# Altium schematic sheet Power.SchDoc
size Letter; Author: Patrick Maroney; Organization: Machine Intelligence Lab; SheetNumber: 2; DocumentName: Status Board
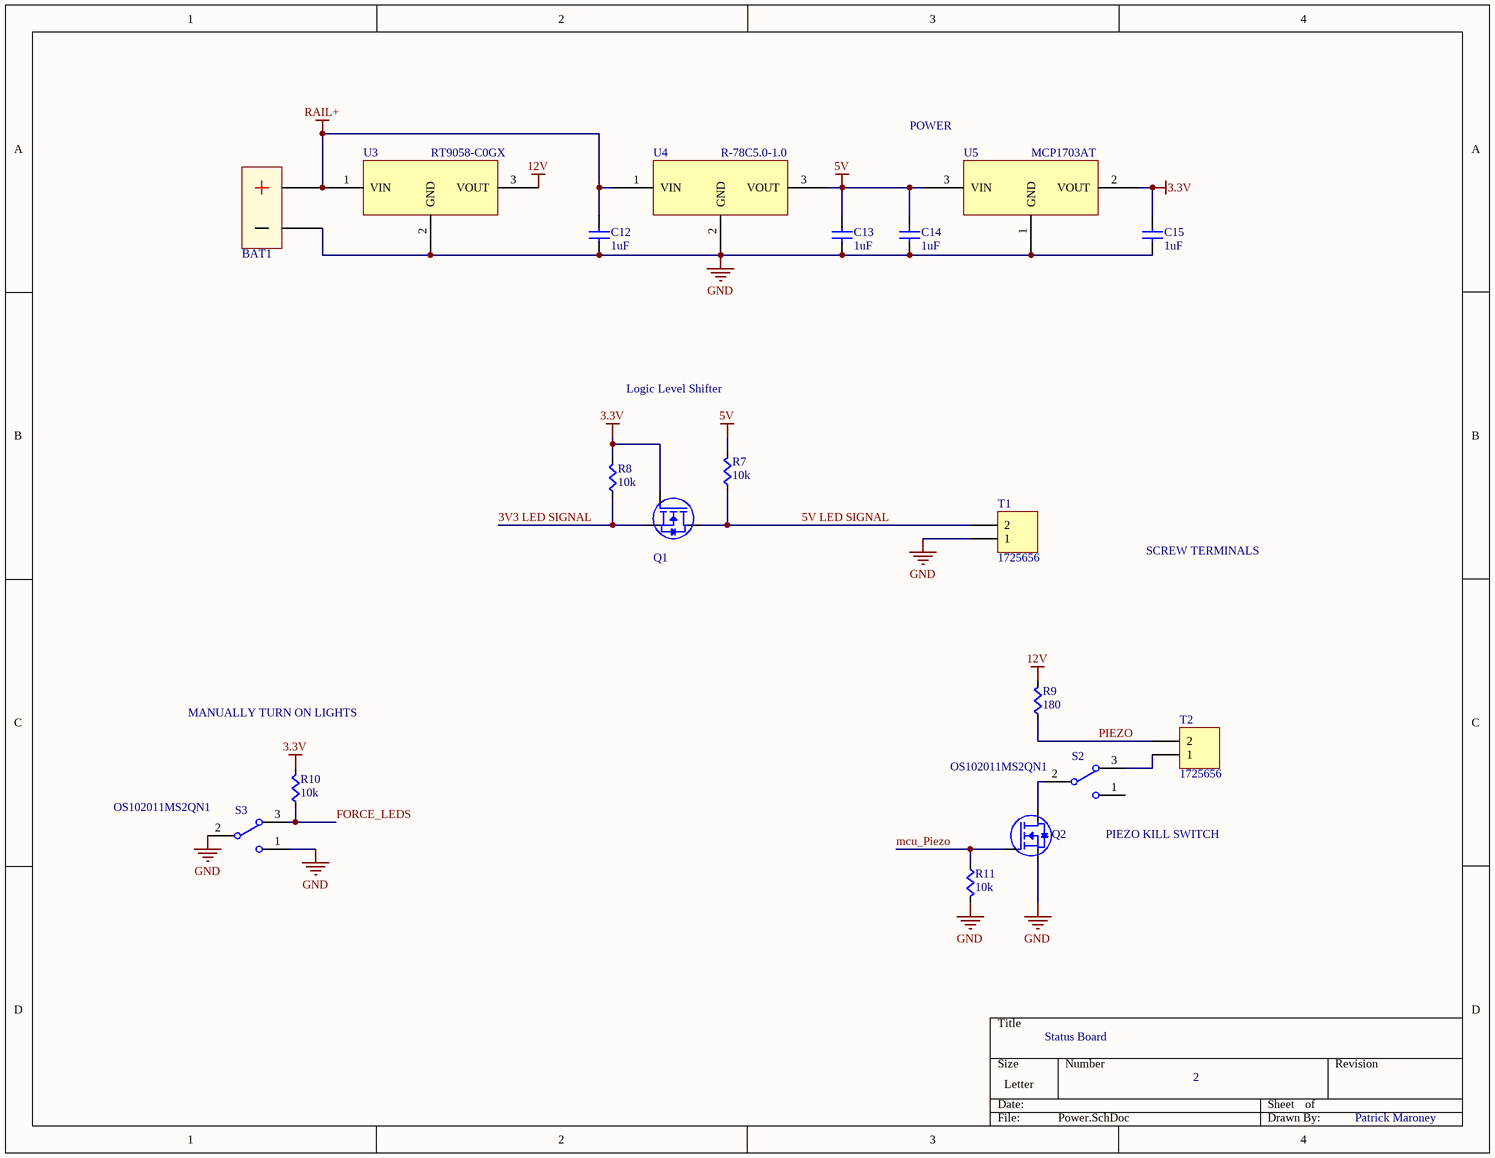
[diagram p0: Power.SchDoc]

## Parts
BAT1  BATWIRE  [BATWIRE12]  (value not drawn)
C12  value 1uF  [CAPC0603]  (hidden comment: Cap)
C13  value 1uF  [CAPC0603]  (hidden comment: Cap)
C14  value 1uF  [CAPC0603]  (hidden comment: Cap)
C15  value 1uF  [CAPC0603]  (hidden comment: Cap)
Q1  BSS138  [BSS138]  (value not drawn)
Q2  TPCA8052-H(TE12LQM  [TPCA8052-H(TE12LQM]  (value not drawn)
R7  value 10k  [RES0603]  (hidden comment: Res)
R8  value 10k  [RES0603]  (hidden comment: Res)
R9  value 180  [RES0603]  (hidden comment: Res)
R10  value 10k  [RES0603]  (hidden comment: Res)
R11  value 10k  [RES0603]  (hidden comment: Res)
S2  OS102011MS2QN1  [OS102011MS2QN1]
S3  OS102011MS2QN1  [OS102011MS2QN1]
T1  1725656  [1725656]
T2  1725656  [1725656]
U3  RT9058-C0GX  [RT9058-C0GX]
U4  R-78C5.0-1.0  [R-78C5.0-1.0]
U5  MCP1703AT  [MCP1703AT-xx02EDB]

## Nets
3.3V: C15.1(A) Q1.G R8.1(A) R10.1(A) U5.2(VOUT)
5V: C13.1(A) C14.1(A) R7.1(A) U4.3(VOUT) U5.3(VIN)
12V: R9.1(A) U3.3(VOUT)
GND: BAT1.- C12.2(B) C13.2(B) C14.2(B) C15.2(B) Q2.S R11.1(A) S3.1 S3.2 T1.1 U3.2(GND) U4.2(GND) U5.1(GND)
RAIL+: BAT1.+ C12.1(A) U3.1(VIN) U4.1(VIN)
3V3 LED SIGNAL: Q1.S R8.2(B)
5V LED SIGNAL: Q1.D R7.2(B) T1.2
FORCE_LEDS: R10.2(B) S3.3
mcu_Piezo: Q2.G R11.2(B)
PIEZO: R9.2(B) T2.2
NetQ2_D: Q2.D S2.2
NetS2_3: S2.3 T2.1

Not connected (* = marked no-connect by the designer): S2 1

## Notes on the sheet
- POWER
- Logic Level Shifter
- SCREW TERMINALS
- MANUALLY TURN ON LIGHTS
- (near S2) PIEZO KILL SWITCH

## Library data of the parts
BAT1 = BATWIRE: Two large gauge leads soldered directly to the board.
Q1 = BSS138: MOSFET N-CH 50V 220MA SOT-23; Supplier 1: Digi-Key; Supplier Part Number 1: BSS138CT-ND
Q2 = TPCA8052-H: MOSFET N-CH 40V 20A 8SOP; Supplier 1: Digi-Key; Supplier Part Number 1: TPCA8052-H(TE12LQMDKR-ND
S2 S3 = OS102011MS2QN1: SWITCH SLIDE SPDT 100MA 12V; Supplier 1: Digi-Key; Supplier Part Number 1: CKN9565-ND
T1 T2 = 1725656: CONN TERM BLOCK 2.54MM 2POS; Supplier 1: Digi-Key; Supplier Part Number 1: 277-1273-ND
U3 = RT9058-C0GX: IC REG LDO 12V 0.1A; Supplier 1: Digi-Key; Supplier Part Number 1: 1028-1307-1-ND
U4 = R-78C5.0-1.0: CONV DC/DC 1A 5V OUT SIP VERT; Supplier 1: Digi-Key; Supplier Part Number 1: 945-1395-5-ND
U5 = MCP1703AT: 250 mA, 16V, Low Quiescent Current LDO Regulator; Supplier 1: Digi-Key; Supplier Part Number 1: MCP1703AT-3302E/CBCT-ND
C12-C15 = Cap: Supplier 1: Digi-Key; Supplier Part Number 1: 1276-1102-1-ND
R7-R11 = Res: Supplier 1: Digi-Key
  R7 R8 R10 R11: Supplier Part Number 1: RMCF0603JT10K0CT-ND
  R9: Supplier Part Number 1: RMCF0603JT180RCT-ND